# Altium schematic sheet Sheet6.SchDoc
size A4; SheetNumber: 6; SheetTotal: 6
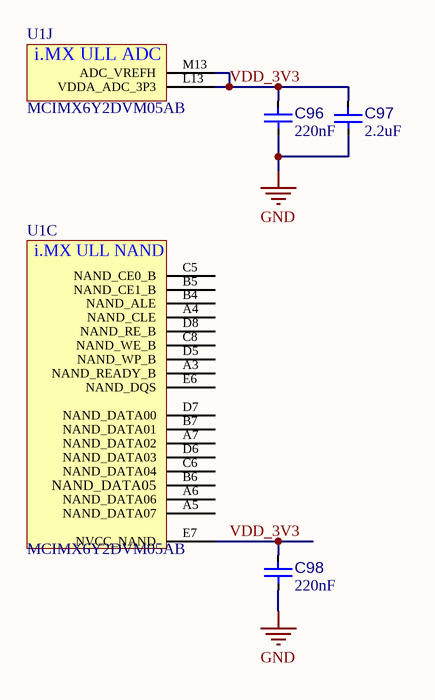
[diagram p0: Sheet6.SchDoc]

## Parts
C96  value 220nF  [0402-SMD-CAP]  (hidden comment: GRM155R71C224KA12D)
C97  value 2.2uF  [0603-SMD-CAP]  (hidden comment: GRM188R71A225KE15D)
C98  value 220nF  [0402-SMD-CAP]  (hidden comment: GRM155R71C224KA12D)
U1  MCIMX6Y2DVM05AB  [BGA100P9X9-81A]  (parts C,J of 11)

## Nets
GND: C96.2 C97.1 C98.2
VDD_3V3: C96.1 C97.2 C98.1 U1.E7(NVCC_NAND) U1.L13(VDDA_ADC_3P3) U1.M13(ADC_VREFH)

Not connected (* = marked no-connect by the designer): U1 A3(NAND_READY_B) A4(NAND_CLE) A5(NAND_DATA07) A6(NAND_DATA06) A7(NAND_DATA02) B4(NAND_ALE) B5(NAND_CE1_B) B6(NAND_DATA05) B7(NAND_DATA01) C5(NAND_CE0_B) C6(NAND_DATA04) C8(NAND_WE_B) D5(NAND_WP_B) D6(NAND_DATA03) D7(NAND_DATA00) D8(NAND_RE_B) E6(NAND_DQS)

## Notes on the sheet
- (in symbol CMP-003-000001-14, part C) i.MX ULL NAND
- (in symbol CMP-003-000001-14, part J) i.MX ULL ADC

## Library data of the parts
C96 C98 = CMP-001-00090-10: MURATA - GRM155R71C224KA12D - SMD Multilayer Ceramic Capacitor, 0.22 µF, 16 V, 0402 [1005 Metric], ± 10%, X7R, GRM Series; Voltage: 16V; Package Quantity: 1; Height: 0.5mm; Tolerance: 10%; Case/Package: 0402; Case Code (Metric): 1005; Packaging: Tape and Reel; Min Operating Temperature: -55°C; Mount: Surface Mount; RoHS Compliant: Yes; Thickness: 0.022inch; Depth: 0.5mm; Lead Free: Lead Free; Series: GRM; REACH SVHC: No SVHC; Width: 0.02inch; Voltage Rating: 16V; Material: Ceramic; Radiation Hardening: No; Voltage Rating (DC): 16V; Capacitance: 220nF; Max Operating Temperature: 125°C; Length: 1mm; Construction: Flat; Dielectric: X7R; Termination: SMD/SMT; Case Code (Imperial): 0402
C97 = CMP-001-00083-8: CAP CER 2.2UF 10V X7R 0603; Tolerance: 10%; Material: Ceramic; Height: 0.8mm; Capacitance: 2.2uF; Case Code (Imperial): 0603; Termination: Standard; Voltage Rating (DC): 10V; Voltage: 10V; RoHS Compliant: Yes; Length: 1.6mm; Thickness: 0.035inch; Case Code (Metric): 1608; REACH SVHC: No SVHC; Package Quantity: 4000; Case/Package: 0603; Mount: Surface Mount; Depth: 0.8mm; Packaging: Cut Tape; Lead Free: Lead Free; Series: GRM; Width: 0.8mm; Dielectric: X7R; Number of Pins: 2; Weight: 0.000222oz; Max Operating Temperature: 125°C; Voltage Rating: 10V; Min Operating Temperature: -55°C
U1 = CMP-003-000001-14: Package: MAPBGA; Design Item ID: MCIMX6Y2DVM05AB; Mfr. Part Nr.: MCIMX6Y2DVM05AB; Source: Schlib1.SchLib